# Altium schematic sheet Power Supply.SchDoc: Modular Parent Motherboard
size Letter; DrawnBy: MTAN; Organization: Altium Limited; Revision: A
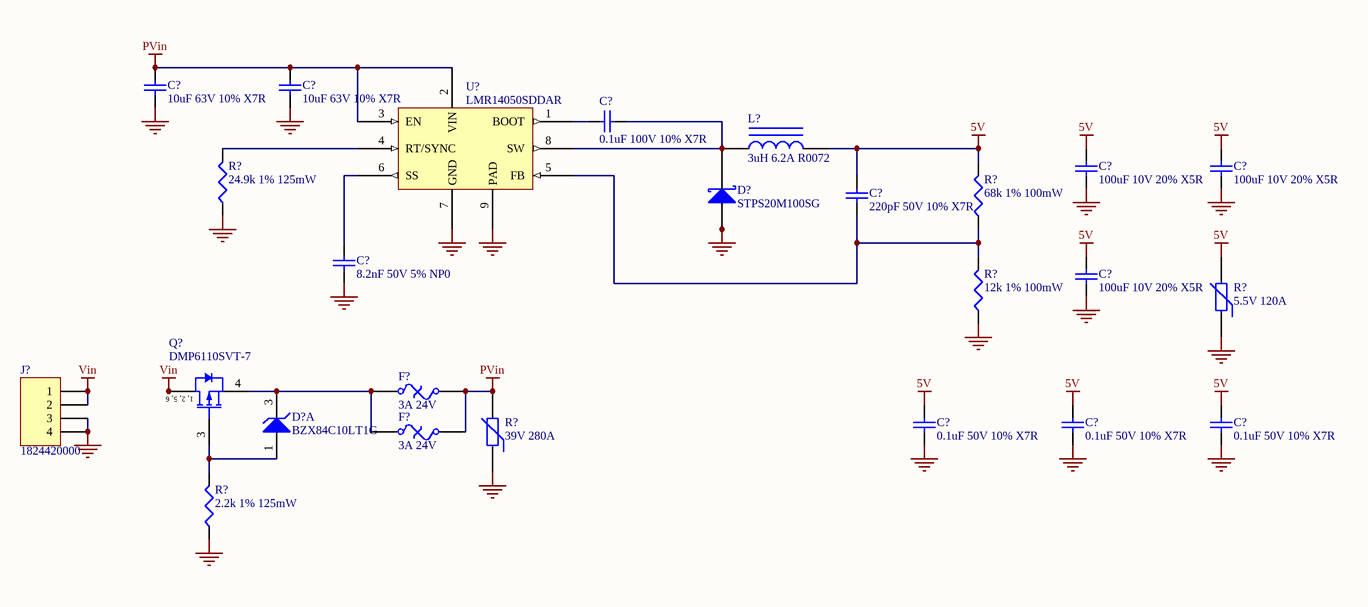
[diagram p0: Power Supply.SchDoc]

## Parts
(Parts that share a designator on the sheet are numbered #1, #2 ... from top to bottom, then left to right.)
C?#1  10uF 63V 10% X7R  [C1210_L]
C?#2  10uF 63V 10% X7R  [C1210_L]
C?#3  0.1uF 100V 10% X7R  [C0805]
C?#4  100uF 10V 20% X5R  [C1210_L]
C?#5  100uF 10V 20% X5R  [C1210_L]
C?#6  220pF 50V 10% X7R  [1608[0603]]
C?#7  8.2nF 50V 5% NP0  [1608[0603]]
C?#8  100uF 10V 20% X5R  [C1210_L]
C?#9  0.1uF 50V 10% X7R  [CAPC1005L]
C?#10  0.1uF 50V 10% X7R  [CAPC1005L]
C?#11  0.1uF 50V 10% X7R  [CAPC1005L]
D?#1  STPS20M100SG  [ONSC-D2PAK-3-418AJ_A_V]
D?#2  BZX84C10LT1G  [SOT23-3_L]  (part A of 2)
F?#1  3A 24V  [2920]
F?#2  3A 24V  [2920]
J?  1824420000  [1824420000]
L?  3uH 6.2A R0072  [SRU1048]
Q?  DMP6110SVT-7  [SOT23-6_L]
R?#1  24.9k 1% 125mW  [6-0805_L]
R?#2  68k 1% 100mW  [J1-0603]
R?#3  12k 1% 100mW  [J1-0603]
R?#4  5.5V 120A  [6-0805_L]
R?#5  39V 280A  [RESC3225L]
R?#6  2.2k 1% 125mW  [6-0805_L]
U?  LMR14050SDDAR  [MRA08A_L]

## Nets
5V: C?#4.2 C?#5.2 C?#6.2 C?#8.2 C?#9.1 C?#10.1 C?#11.1 L?.2 R?#2.2 R?#4.2
GND: C?#1.1 C?#2.1 C?#4.1 C?#5.1 C?#7.1 C?#8.1 C?#9.2 C?#10.2 C?#11.2 D?#1.1(A) D?#1.3(A) J?.3 J?.4 R?#1.1 R?#3.1 R?#4.1 R?#5.1 R?#6.1 U?.7(GND) U?.9(PAD)
PVin: C?#1.2 C?#2.2 F?#1.2 F?#2.2 R?#5.2 U?.2(VIN) U?.3(EN)
Vin: J?.1 J?.2 Q?.1(D) Q?.2(D) Q?.5(D) Q?.6(D)
NetC?#3_1: C?#3.1 D?#1.4(K) L?.1 U?.8(SW)
NetC?#3_2: C?#3.2 U?.1(BOOT)
NetC?#6_1: C?#6.1 R?#2.1 R?#3.2 U?.5(FB)
NetC?#7_2: C?#7.2 U?.6(SS)
NetD?#2_1: D?#2.1(A) Q?.3(G) R?#6.2
NetD?#2_3: D?#2.3(K) F?#1.1 F?#2.1 Q?.4(S)
NetR?#1_2: R?#1.2 U?.4(RT/SYNC)

## Notes on the sheet
- Title
- Drawn By:
- Date:
- Time:
- Revision:
- Sheet
- of
- The Latium Group of Companies
- 1312 10 Street
- Nisku, Alberta
- T9E 8K2
- Canada
- File:
- (in symbol NTGS3136PT1G) 1, 2, 5, 6

## Library data of the parts
C?#1-C?#11 = Cap: Capacitor
  C?#1 C?#2: Value: 10uF 63V 10% X7R
  C?#3: Value: 0.1uF 100V 10% X7R
  C?#4 C?#5 C?#8: Value: 100uF 10V 20% X5R
  C?#6: Value: 220pF 50V 10% X7R
  C?#7: Value: 8.2nF 50V 5% NP0
  C?#9-C?#11: Value: 0.1uF 50V 10% X7R
D?#1 = BAS70: DIODE SCHOTTKY 100V 20A D2PAK; Manufacturer: STMicroelectronics; ComponentLink2Description: Datasheet; ComponentLink2URL: S:\Hardware\Data Sheets\Passive\Diodes\STPS20M100.pdf; Value: STPS20M100SG; Manufacturer Part Number: STPS20M100SG; Supplier 1: Digi-Key; Supplier 1 Part Number: 497-10993-1-ND
D?#2 = BZX84C10LT1G: DIODE ZENER 10V 225MW SOT23-3; Manufacturer: On Semiconductor; Supplier 1: Digi-Key; Supplier 1 Part Number: BZX84C10LT1GOSCT-ND; ComponentLink1Description: Data Sheet; ComponentLink1URL: S:\Hardware\Data Sheets\Passive\Diodes\BZX84C2V4LT1-D.pdf; Value: BZX84C10LT1G; Manufacturer Part Number: BZX84C10LT1G
F?#1 F?#2 = Fuse Thermal: Thermal Fuse; Manufacturer Part Number: SMDC300F/24-2; Manufacturer: Littelfuse Inc; Value: 3A 24V; Supplier 1: Digi-Key; Supplier 1 Part Number: SMDC300F/24-2CT-ND
J? = Header 4H: TERM BLK 2POS SIDE ENT 3.5MM PCB; Manufacturer: Weidmuller; Value: 1824420000; Manufacturer Part Number: 1824420000; Supplier 1: Digi-Key; Supplier 1 Part Number: 281-2020-ND
L? = Inductor Iron: FIXED IND 3UH 6.2A 7.2 MOHM SMD; Manufacturer Part Number: SRU1048-3R0Y; Manufacturer: Bourns Inc; Value: 3uH 6.2A R0072; Supplier 1: Digi-Key; Supplier 1 Part Number: SRU1048-3R0YCT-ND; ComponentLink1Description: Data Sheet; ComponentLink1URL: S:\Hardware\Data Sheets\Passive\Inductors\SRU1048.pdf
Q? = NTGS3136PT1G: MOSFET P-CH 60V TSOT26; Manufacturer: Diodes Incorporated; ComponentLink1Description: Data Sheet; ComponentLink1URL: S:\Hardware\Data Sheets\Passive\FETs\DMP6110SVT.pdf; Value: DMP6110SVT-7; Manufacturer Part Number: DMP6110SVT-7; Supplier 1: Digi-Key; Supplier 1 Part Number: DMP6110SVT-7DICT-ND
R?#1-R?#3 R?#6 = Res3: Resistor
  R?#1: Value: 24.9k 1% 125mW
  R?#2: Value: 68k 1% 100mW
  R?#3: Value: 12k 1% 100mW
  R?#6: Value: 2.2k 1% 125mW
R?#4 = Res Varistor: VARISTOR 8.2V 120A 0805; Manufacturer: Littelfuse Inc; Manufacturer Part Number: V5.5MLA0805H; Value: 5.5V 120A; Supplier 1: Digi-Key; Supplier 1 Part Number: F2215CT-ND
R?#5 = Res Varistor: VARISTOR 39V 280A 1210; Manufacturer: Littelfuse Inc; Manufacturer Part Number: V30MLA1210NH; Value: 39V 280A; Supplier 1: Digi-Key; Supplier 1 Part Number: F3825CT-ND
U? = LMR14050: IC REG BUCK ADJUSTABLE 5A 8SOPWR; Manufacturer: Texas Instruments; Value: LMR14050SDDAR; Manufacturer Part Number: LMR14050SDDAR; Supplier 1: Digi-Key; Supplier 1 Part Number: 296-44322-1-ND; ComponentLink1Description: Data Sheet; ComponentLink1URL: S:\Hardware\Data Sheets\Active\Voltage Regulators\lmr14050.pdf